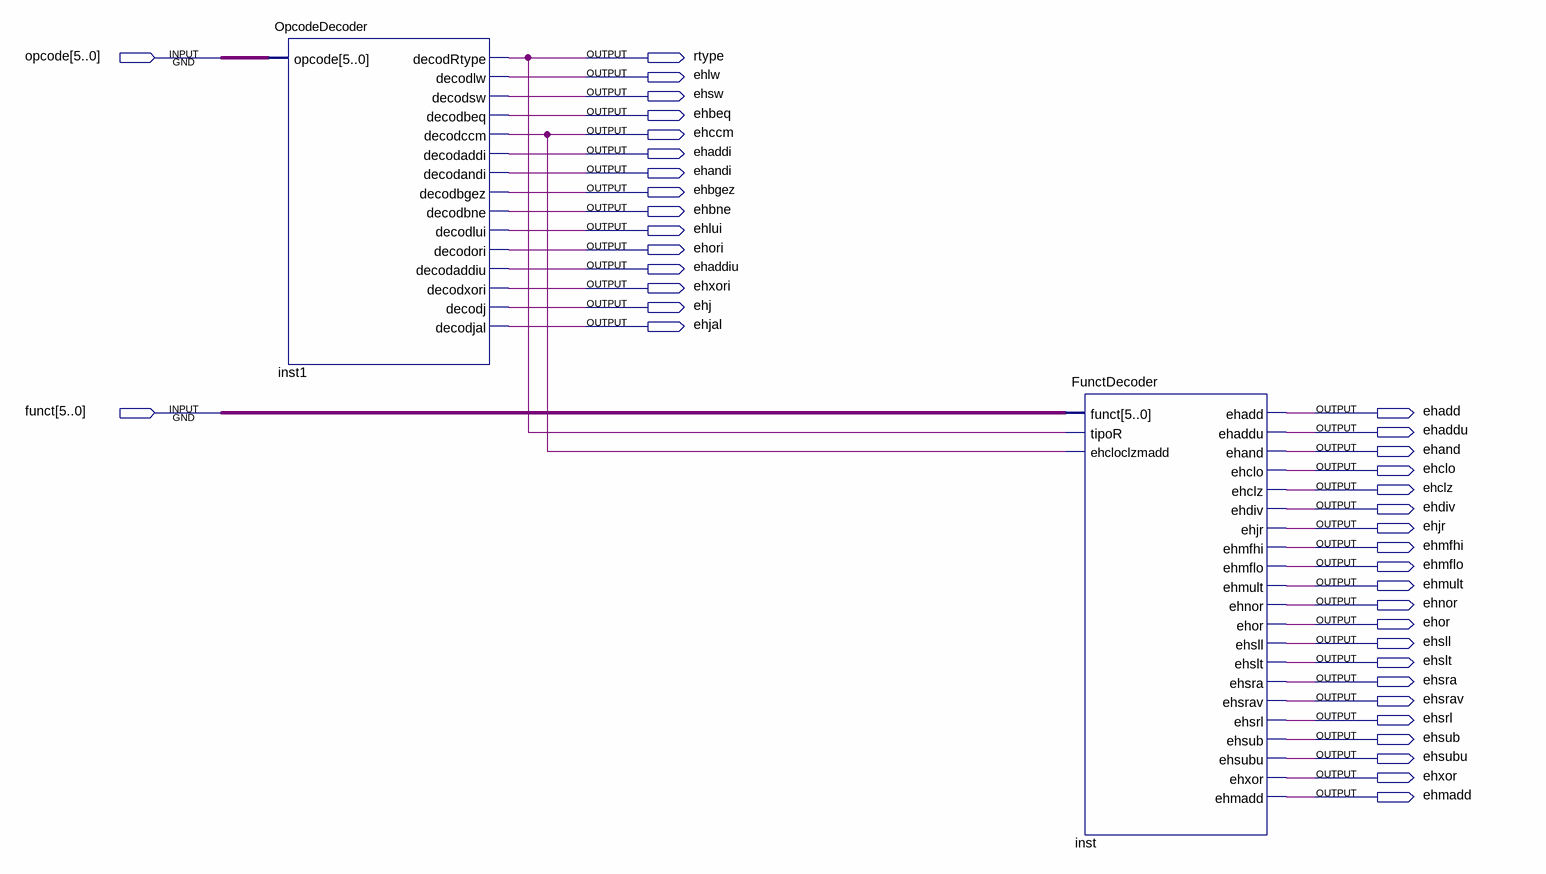
[diagram p0: schematic sheet]
// Quartus schematic teste.bdf as structural Verilog: 2 symbols, 38 pins
module teste (
  input  [5:0] opcode,
  input  [5:0] funct,
  output rtype,
  output ehlw,
  output ehsw,
  output ehbeq,
  output ehccm,
  output ehaddi,
  output ehandi,
  output ehbgez,
  output ehbne,
  output ehlui,
  output ehori,
  output ehaddiu,
  output ehxori,
  output ehj,
  output ehjal,
  output ehadd,
  output ehaddu,
  output ehand,
  output ehclo,
  output ehclz,
  output ehdiv,
  output ehjr,
  output ehmfhi,
  output ehmflo,
  output ehmult,
  output ehnor,
  output ehor,
  output ehsll,
  output ehslt,
  output ehsra,
  output ehsrav,
  output ehsrl,
  output ehsub,
  output ehsubu,
  output ehxor,
  output ehmadd
);

  OpcodeDecoder inst1 (
    .opcode(opcode), .decodRtype(rtype), .decodlw(ehlw), .decodsw(ehsw), .decodbeq(ehbeq), .decodccm(ehccm),
    .decodaddi(ehaddi), .decodandi(ehandi), .decodbgez(ehbgez), .decodbne(ehbne), .decodlui(ehlui),
    .decodori(ehori), .decodaddiu(ehaddiu), .decodxori(ehxori), .decodj(ehj), .decodjal(ehjal));
  FunctDecoder inst (
    .funct(funct), .tipoR(rtype), .ehcloclzmadd(ehccm), .ehadd(ehadd), .ehaddu(ehaddu), .ehand(ehand),
    .ehclo(ehclo), .ehclz(ehclz), .ehdiv(ehdiv), .ehjr(ehjr), .ehmfhi(ehmfhi), .ehmflo(ehmflo),
    .ehmult(ehmult), .ehnor(ehnor), .ehor(ehor), .ehsll(ehsll), .ehslt(ehslt), .ehsra(ehsra),
    .ehsrav(ehsrav), .ehsrl(ehsrl), .ehsub(ehsub), .ehsubu(ehsubu), .ehxor(ehxor), .ehmadd(ehmadd));
endmodule
